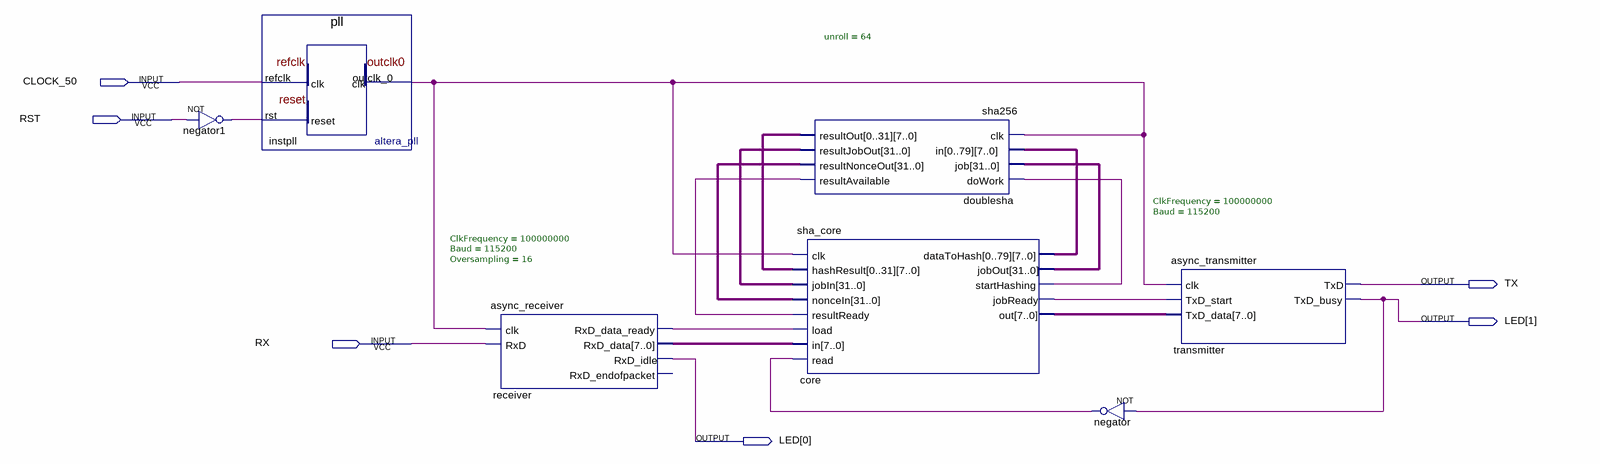
[diagram p0: schematic sheet]
// Quartus schematic sha_miner_top.bdf as structural Verilog: 7 symbols, 6 pins
module sha_miner_top (
  input  CLOCK_50,
  input  RST,
  input  RX,
  output TX,
  output [1:0] LED
);

  wire core_jobready, core_starthashing, doublesha_resultavailable, instpll_outclk_0, negator1_out,
       negator_out, receiver_rxd_data_ready;
  wire [7:0] core_out, receiver_rxd_data;
  wire [31:0] core_jobout, doublesha_resultjobout, doublesha_resultnonceout;
  wire [255:0] doublesha_resultout;
  wire [639:0] core_datatohash;

  not negator1 (negator1_out, RST);
  pll instpll (.refclk(CLOCK_50), .rst(negator1_out), .outclk_0(instpll_outclk_0));
  async_receiver #(.ClkFrequency(100000000), .Baud(115200), .Oversampling(16)) receiver (
    .clk(instpll_outclk_0), .RxD(RX), .RxD_data_ready(receiver_rxd_data_ready), .RxD_data(receiver_rxd_data),
    .RxD_idle(LED[0]));  // open: RxD_endofpacket
  sha256 #(.unroll(64)) doublesha (
    .clk(instpll_outclk_0), .in(core_datatohash), .job(core_jobout), .doWork(core_starthashing),
    .resultOut(doublesha_resultout), .resultJobOut(doublesha_resultjobout),
    .resultNonceOut(doublesha_resultnonceout), .resultAvailable(doublesha_resultavailable));
  sha_core core (
    .clk(instpll_outclk_0), .hashResult(doublesha_resultout), .jobIn(doublesha_resultjobout),
    .nonceIn(doublesha_resultnonceout), .resultReady(doublesha_resultavailable),
    .load(receiver_rxd_data_ready), .in(receiver_rxd_data), .read(negator_out), .dataToHash(core_datatohash),
    .jobOut(core_jobout), .startHashing(core_starthashing), .jobReady(core_jobready), .out(core_out));
  not negator (negator_out, LED[1]);
  async_transmitter #(.ClkFrequency(100000000), .Baud(115200)) transmitter (
    .clk(instpll_outclk_0), .TxD_start(core_jobready), .TxD_data(core_out), .TxD(TX), .TxD_busy(LED[1]));
endmodule
